# EAGLE schematic Emu_submod_template (EAGLE 7.2.0)
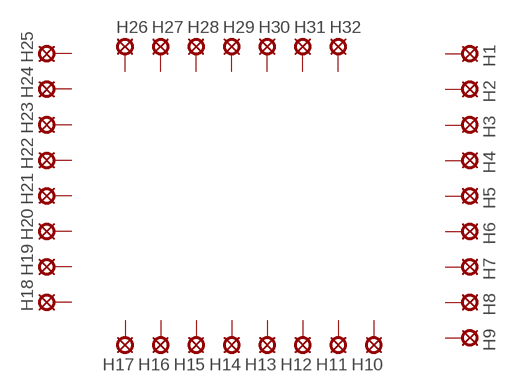
[diagram p0: schematic, sheet 1]

## Parts
H1  LSP13  [LSP13]
H2  LSP13  [LSP13]
H3  LSP13  [LSP13]
H4  LSP13  [LSP13]
H5  LSP13  [LSP13]
H6  LSP13  [LSP13]
H7  LSP13  [LSP13]
H8  LSP13  [LSP13]
H9  LSP13  [LSP13]
H10  LSP13  [LSP13]
H11  LSP13  [LSP13]
H12  LSP13  [LSP13]
H13  LSP13  [LSP13]
H14  LSP13  [LSP13]
H15  LSP13  [LSP13]
H16  LSP13  [LSP13]
H17  LSP13  [LSP13]
H18  LSP13  [LSP13]
H19  LSP13  [LSP13]
H20  LSP13  [LSP13]
H21  LSP13  [LSP13]
H22  LSP13  [LSP13]
H23  LSP13  [LSP13]
H24  LSP13  [LSP13]
H25  LSP13  [LSP13]
H26  LSP13  [LSP13]
H27  LSP13  [LSP13]
H28  LSP13  [LSP13]
H29  LSP13  [LSP13]
H30  LSP13  [LSP13]
H31  LSP13  [LSP13]
H32  LSP13  [LSP13]
Unconnected: H1.MP H2.MP H3.MP H4.MP H5.MP H6.MP H7.MP H8.MP H9.MP H10.MP H11.MP H12.MP H13.MP H14.MP H15.MP H16.MP H17.MP H18.MP H19.MP H20.MP H21.MP H22.MP H23.MP H24.MP H25.MP H26.MP H27.MP H28.MP H29.MP H30.MP H31.MP H32.MP

## Library data of the parts
H1-H32 = solpad:LSP13: SOLDER PAD drill 1.3 mm, distributor Buerklin, 12H562